# EAGLE design PCM3060 Guitar Cape (EAGLE 6.6.0)
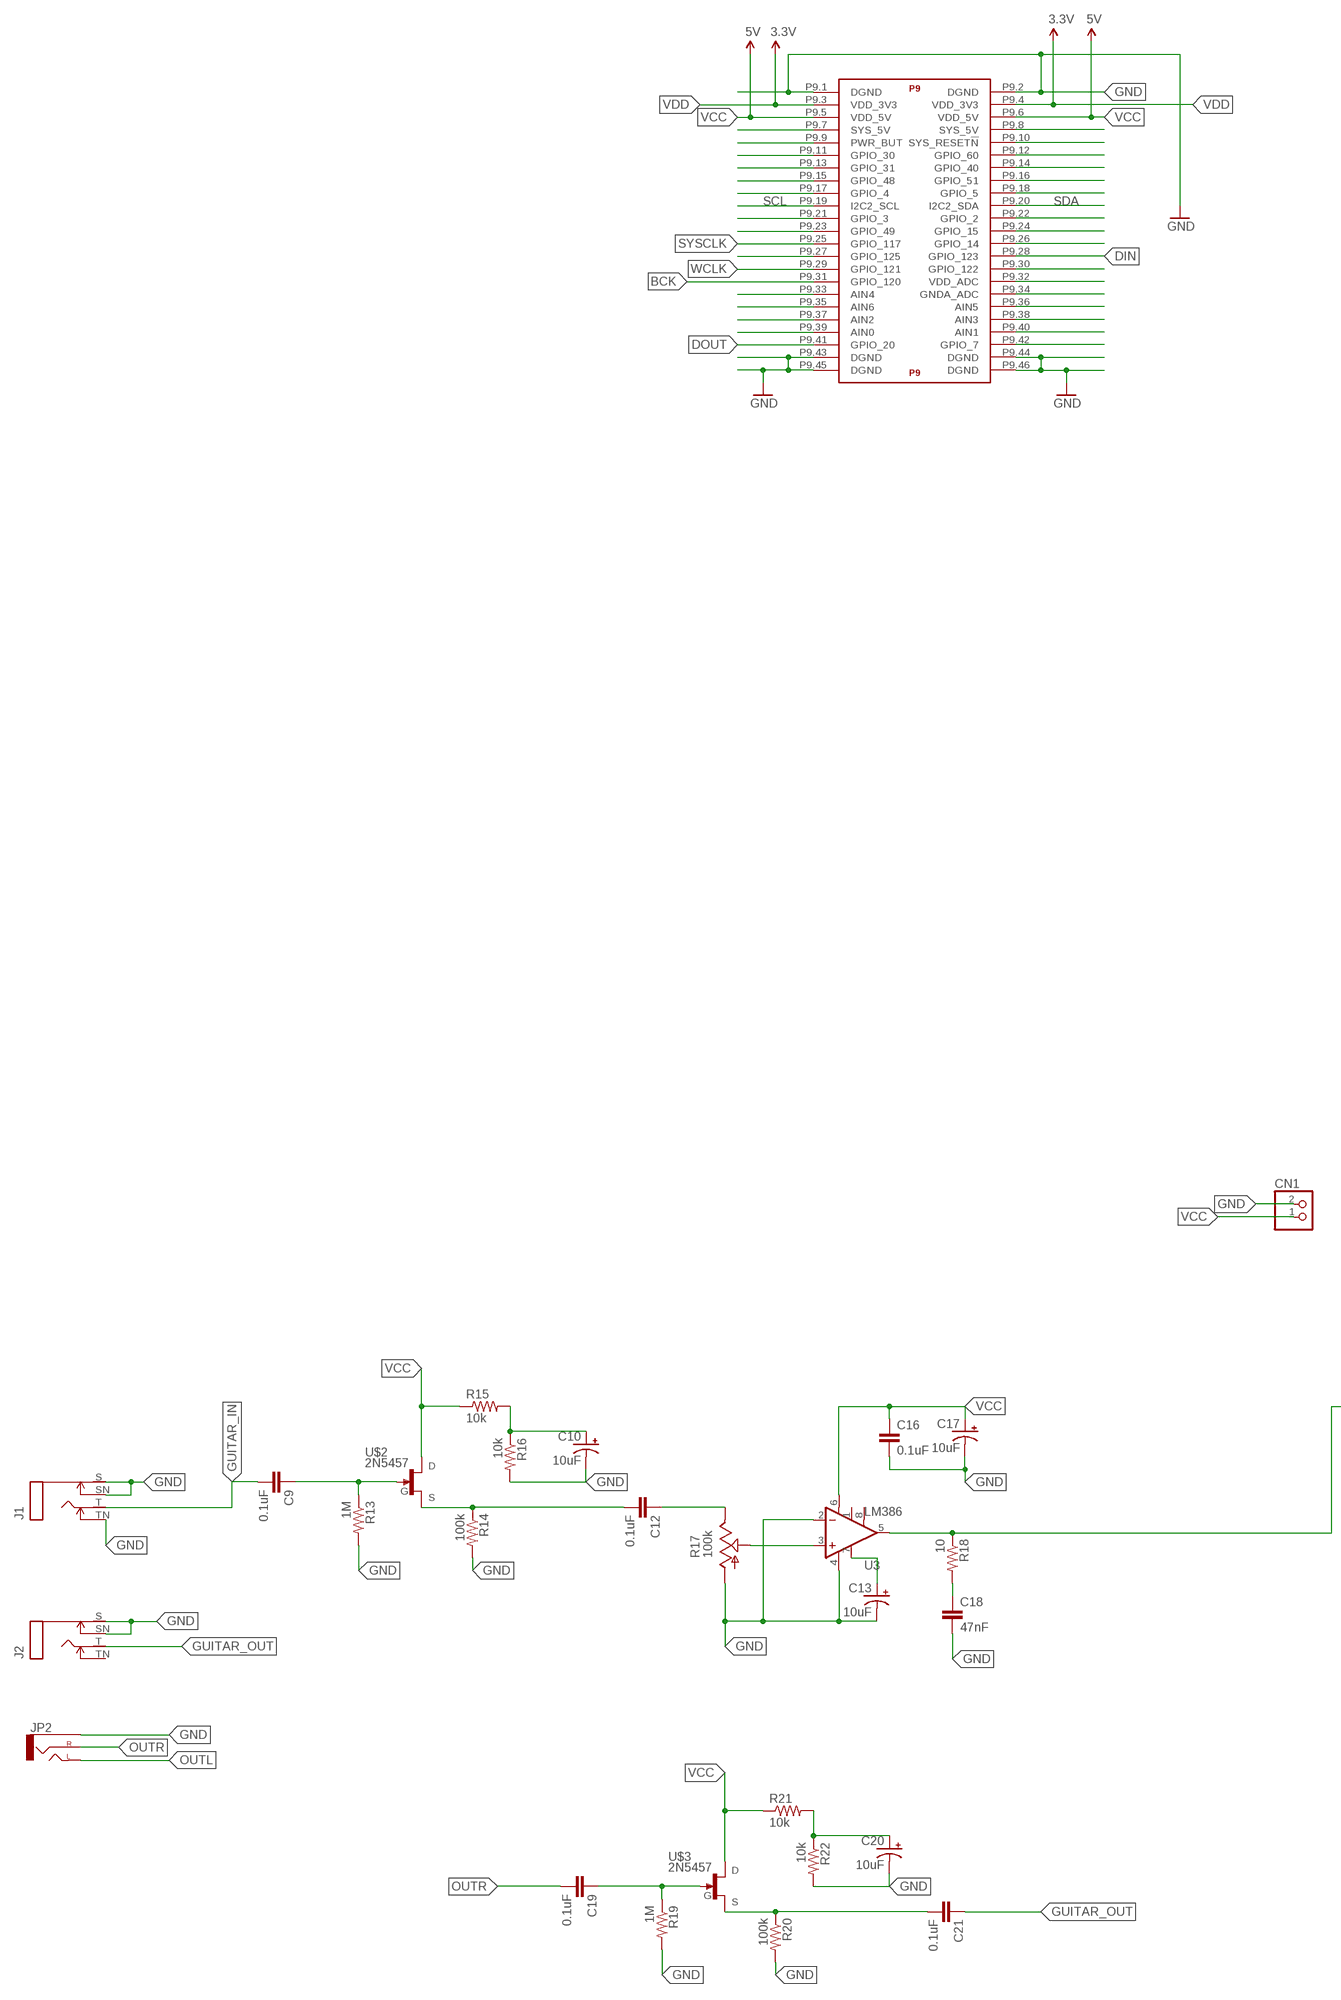
[diagram p0: schematic, sheet 1, part 1 of 2]
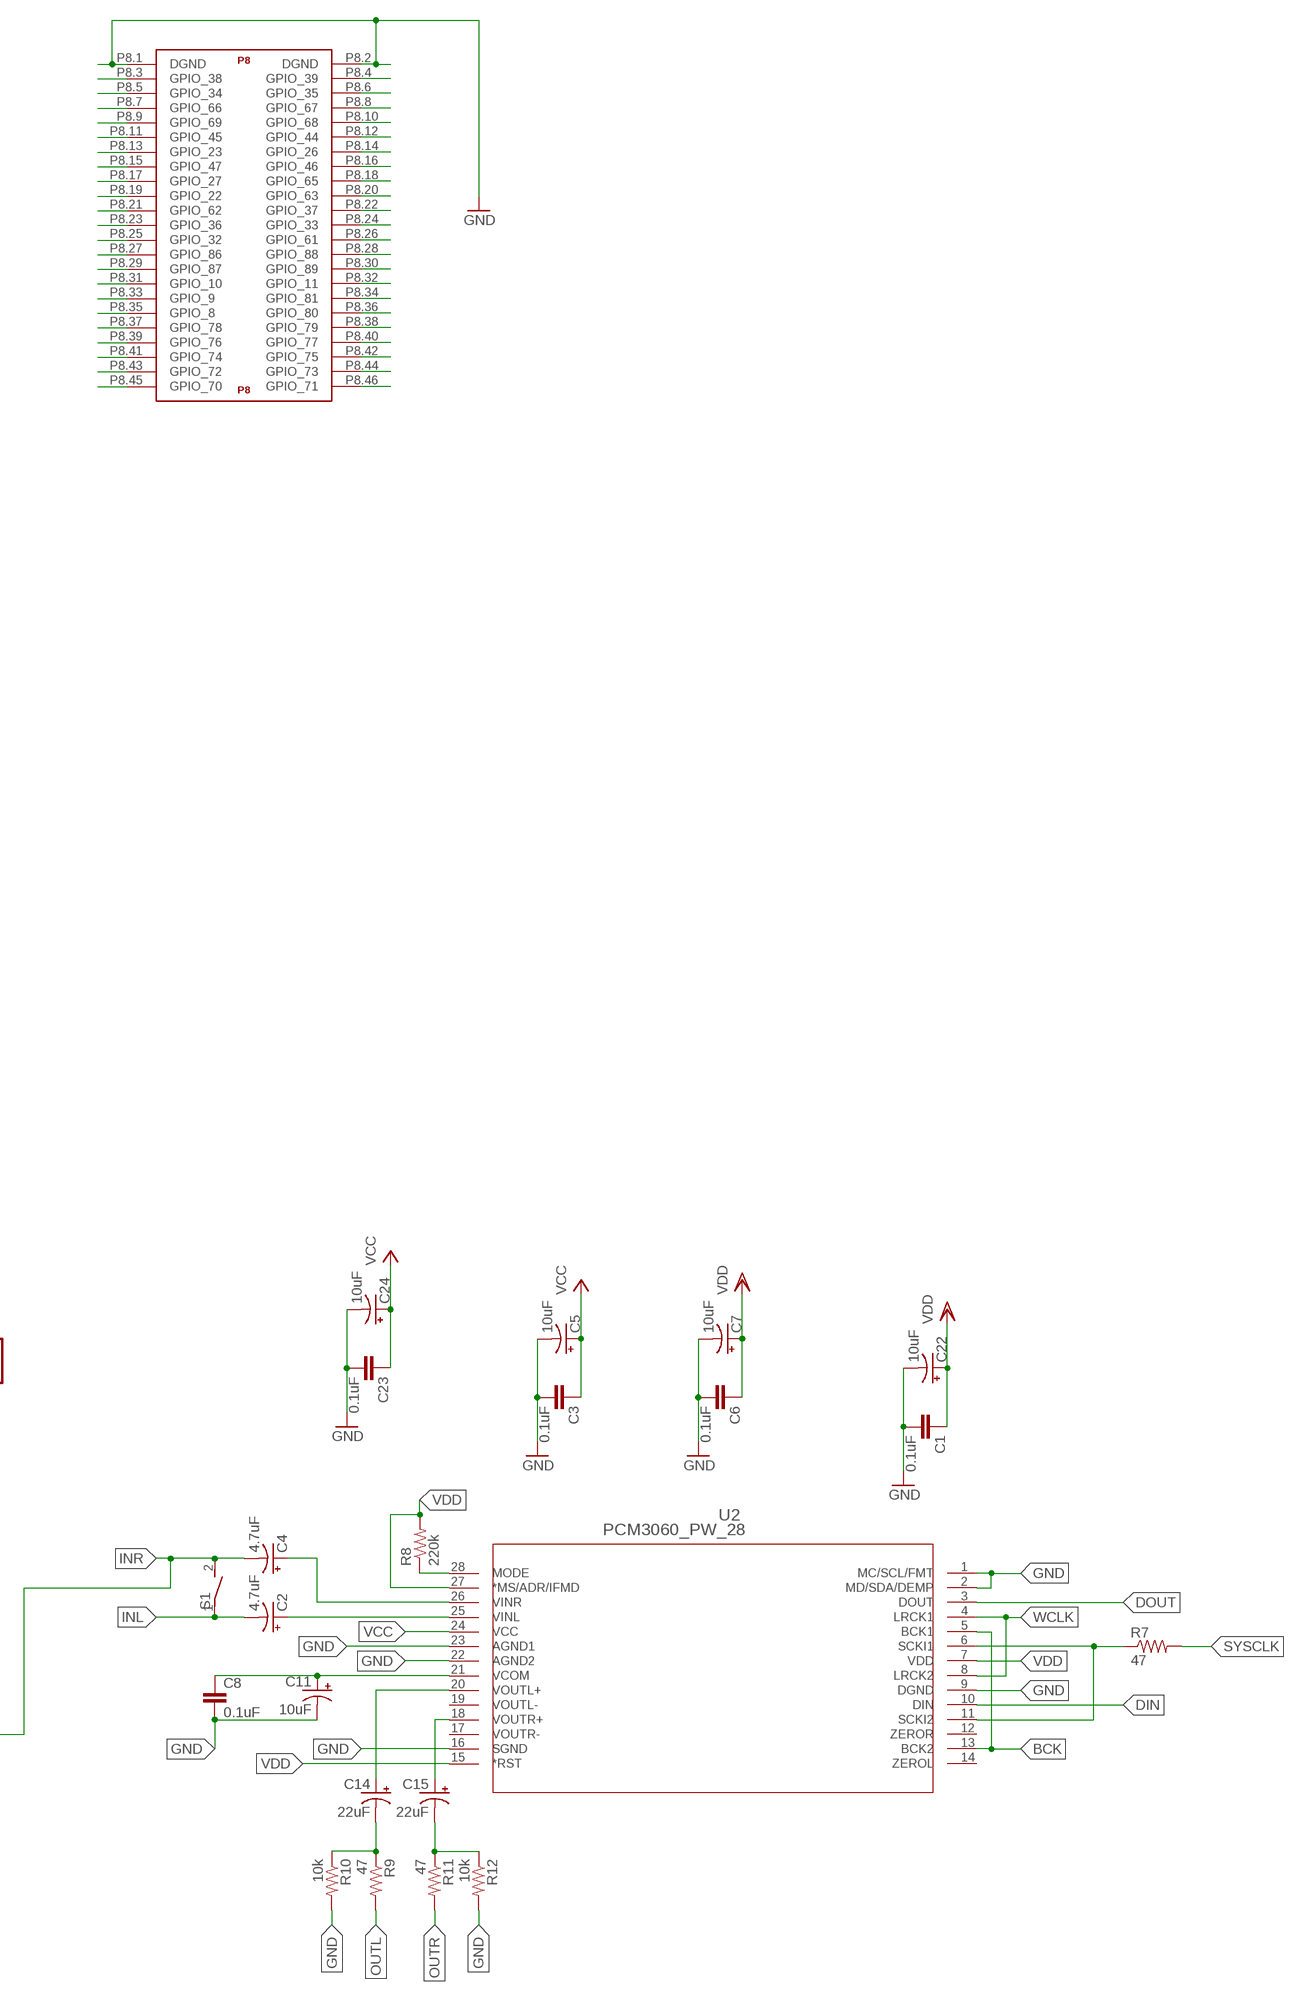
[diagram p1: schematic, sheet 1, part 2 of 2]

## Parts
C1  0.1uF  0.1UF-25V-5%(0603)  [0603-CAP]
C2  4.7uF  CAP_POLPTH2  [CPOL-RADIAL-10UF-25V]
C3  0.1uF  0.1UF-25V-5%(0603)  [0603-CAP]
C4  4.7uF  CAP_POLPTH2  [CPOL-RADIAL-10UF-25V]
C5  10uF  CAP_POLPTH2  [CPOL-RADIAL-10UF-25V]
C6  0.1uF  0.1UF-25V-5%(0603)  [0603-CAP]
C7  10uF  CAP_POLPTH2  [CPOL-RADIAL-10UF-25V]
C8  0.1uF  0.1UF-25V-5%(0603)  [0603-CAP]
C9  0.1uF  0.1UF-25V-5%(0603)  [0603-CAP]
C10  10uF  CAP_POLPTH2  [CPOL-RADIAL-10UF-25V]
C11  10uF  CAP_POLPTH2  [CPOL-RADIAL-10UF-25V]
C12  0.1uF  0.1UF-25V-5%(0603)  [0603-CAP]
C13  10uF  CAP_POLPTH2  [CPOL-RADIAL-10UF-25V]
C14  22uF  CAP_POLPTH2  [CPOL-RADIAL-10UF-25V]
C15  22uF  CAP_POLPTH2  [CPOL-RADIAL-10UF-25V]
C16  0.1uF  0.1UF-25V-5%(0603)  [0603-CAP]
C17  10uF  CAP_POLPTH2  [CPOL-RADIAL-10UF-25V]
C18  47nF  47NF(0.047UF/47000PF)-25V-5%(0603)SMD  [0603-CAP]
C19  0.1uF  0.1UF-25V-5%(0603)  [0603-CAP]
C20  10uF  CAP_POLPTH2  [CPOL-RADIAL-10UF-25V]
C21  0.1uF  0.1UF-25V-5%(0603)  [0603-CAP]
C22  10uF  CAP_POLPTH2  [CPOL-RADIAL-10UF-25V]
C23  0.1uF  0.1UF-25V-5%(0603)  [0603-CAP]
C24  10uF  CAP_POLPTH2  [CPOL-RADIAL-10UF-25V]
CN1  JST_2PIN-THM  [JST-PH-2-THM]
J1  MONOSW  [NMJ4HCD2]
J2  MONOSW  [NMJ4HCD2]
JP2  AUDIO-JACK2.5MM  [STEREOJACK2.5MM_STEREOJACK2.5MM]
R7  47  RESISTOR1206  [1206]
R8  220k  RESISTOR1206  [1206]
R9  47  RESISTOR1206  [1206]
R10  10k  RESISTOR1206  [1206]
R11  47  RESISTOR1206  [1206]
R12  10k  RESISTOR1206  [1206]
R13  1M  RESISTOR1206  [1206]
R14  100k  RESISTOR1206  [1206]
R15  10k  RESISTOR1206  [1206]
R16  10k  RESISTOR1206  [1206]
R17  100k  TRIM_US-RJ9W  [RJ9W]
R18  10  RESISTOR1206  [1206]
R19  1M  RESISTOR1206  [1206]
R20  100k  RESISTOR1206  [1206]
R21  10k  RESISTOR1206  [1206]
R22  10k  RESISTOR1206  [1206]
S1  DS01E  [DS-01]
U2  PCM3060_PW_28  [PW28]
U3  LM386  [DIP08]
U$1  BEAGLE_BONE_BLACK_CAPE  [BEAGLE_BONE_BLACK_CAPE]
U$2  2N5457  [TO-92]
U$3  2N5457  [TO-92]

## Nets
BCK: U2.5(BCK1) U2.13(BCK2) U$1.P9.31(P9:GPIO_120)
DIN: U2.10(DIN) U$1.P9.28(P9:GPIO_123)
DOUT: U2.3(DOUT) U$1.P9.41(P9:GPIO_20)
GND: C1.2 C3.2 C5.2(-) C6.2 C7.2(-) C8.2 C10.2(-) C11.2(-) C13.2(-) C16.2 C17.2(-) C18.2 C20.2(-) C22.2(-) C23.2 C24.2(-) CN1.2 J1.S J1.SN J1.TN J2.S J2.SN JP2.RING1(SLEEVE) R10.2 R12.2 R13.2 R14.2 R16.2 R17.A R19.2 R20.2 R22.2 U2.1(MC/SCL/FMT) U2.2(MD/SDA/DEMP) U2.9(DGND) U2.16(SGND) U2.22(AGND2) U2.23(AGND1) U3.2(-IN) U3.4(V-) U$1.P8.1(P8:DGND) U$1.P8.2(P8:DGND) U$1.P9.1(P9:DGND) U$1.P9.2(P9:DGND) U$1.P9.43(P9:DGND) U$1.P9.44(P9:DGND) U$1.P9.45(P9:DGND) U$1.P9.46(P9:DGND)
GUITAR_IN: C9.2 J1.T
GUITAR_OUT: C21.1 J2.T
INL: C2.2(-) S1.1
INR: C4.2(-) R18.1 S1.2 U3.5(OUT)
N$2: U$1.P8.45(P8:GPIO_70)
N$3: C2.1(+) U2.25(VINL)
N$4: U$1.P8.43(P8:GPIO_72)
N$5: U$1.P8.41(P8:GPIO_74)
N$7: R7.1 U2.6(SCKI1) U2.11(SCKI2)
N$8: C8.1 C11.1(+) U2.21(VCOM)
N$9: U$1.P8.39(P8:GPIO_76)
N$12: U$1.P8.37(P8:GPIO_78)
N$13: U$1.P8.35(P8:GPIO_8)
N$14: U$1.P8.33(P8:GPIO_9)
N$15: U$1.P8.31(P8:GPIO_10)
N$16: U$1.P8.29(P8:GPIO_87)
N$17: U$1.P8.27(P8:GPIO_86)
N$18: U$1.P8.25(P8:GPIO_32)
N$19: U$1.P8.23(P8:GPIO_36)
N$20: U$1.P8.21(P8:GPIO_62)
N$21: U$1.P8.19(P8:GPIO_22)
N$22: U$1.P8.17(P8:GPIO_27)
N$23: U$1.P8.15(P8:GPIO_47)
N$24: U$1.P8.13(P8:GPIO_23)
N$25: U$1.P8.11(P8:GPIO_45)
N$26: U$1.P8.9(P8:GPIO_69)
N$27: U$1.P8.7(P8:GPIO_66)
N$28: U$1.P8.5(P8:GPIO_34)
N$29: U$1.P8.3(P8:GPIO_38)
N$30: R8.1 U2.28(MODE)
N$31: U$1.P8.46(P8:GPIO_71)
N$32: U$1.P8.44(P8:GPIO_73)
N$33: U$1.P8.42(P8:GPIO_75)
N$34: U$1.P8.40(P8:GPIO_77)
N$35: U$1.P8.38(P8:GPIO_79)
N$36: U$1.P8.36(P8:GPIO_80)
N$37: U$1.P8.34(P8:GPIO_81)
N$38: U$1.P8.32(P8:GPIO_11)
N$39: U$1.P8.30(P8:GPIO_89)
N$40: U$1.P8.28(P8:GPIO_88)
N$41: U$1.P8.26(P8:GPIO_61)
N$42: U$1.P8.24(P8:GPIO_33)
N$43: U$1.P8.22(P8:GPIO_37)
N$44: U$1.P8.20(P8:GPIO_63)
N$45: U$1.P8.18(P8:GPIO_65)
N$46: U$1.P8.16(P8:GPIO_46)
N$47: U$1.P8.14(P8:GPIO_26)
N$48: U$1.P8.12(P8:GPIO_44)
N$49: U$1.P8.10(P8:GPIO_68)
N$50: U$1.P8.8(P8:GPIO_67)
N$51: U$1.P8.6(P8:GPIO_35)
N$52: U$1.P8.4(P8:GPIO_39)
N$53: C4.1(+) U2.26(VINR)
N$54: C14.1(+) U2.20(VOUTL+)
N$55: C15.1(+) U2.18(VOUTR+)
N$56: U$1.P9.42(P9:GPIO_7)
N$57: U$1.P9.40(P9:AIN1)
N$58: U$1.P9.38(P9:AIN3)
N$59: U$1.P9.36(P9:AIN5)
N$60: U$1.P9.34(P9:GNDA_ADC)
N$61: U$1.P9.32(P9:VDD_ADC)
N$62: U$1.P9.30(P9:GPIO_122)
N$64: U$1.P9.26(P9:GPIO_14)
N$65: U$1.P9.24(P9:GPIO_15)
N$66: U$1.P9.22(P9:GPIO_2)
N$67: C14.2(-) R9.1 R10.1
N$68: U$1.P9.18(P9:GPIO_5)
N$69: U$1.P9.16(P9:GPIO_51)
N$70: U$1.P9.14(P9:GPIO_40)
N$71: U$1.P9.12(P9:GPIO_60)
N$72: U$1.P9.10(P9:SYS_RESET!N)
N$73: U$1.P9.8(P9:SYS_5V)
N$74: C15.2(-) R11.1 R12.1
N$75: C9.1 R13.1 U$2.3(G)
N$76: C12.2 R14.1 U$2.2(S)
N$77: C10.1(+) R15.2 R16.1
N$78: R17.S U3.3(+IN)
N$80: U$1.P9.39(P9:AIN0)
N$81: U$1.P9.37(P9:AIN2)
N$82: U$1.P9.35(P9:AIN6)
N$83: U$1.P9.33(P9:AIN4)
N$86: U$1.P9.27(P9:GPIO_125)
N$88: U$1.P9.23(P9:GPIO_49)
N$89: U$1.P9.21(P9:GPIO_3)
N$90: C13.1(+) U3.7(BP)
N$91: U$1.P9.17(P9:GPIO_4)
N$92: U$1.P9.15(P9:GPIO_48)
N$93: U$1.P9.13(P9:GPIO_31)
N$94: U$1.P9.11(P9:GPIO_30)
N$95: U$1.P9.9(P9:PWR_BUT)
N$96: U$1.P9.7(P9:SYS_5V)
N$97: C18.1 R18.2
N$98: C12.1 R17.E
N$99: C19.1 R19.1 U$3.3(G)
N$100: C21.2 R20.1 U$3.2(S)
N$101: C20.1(+) R21.2 R22.1
OUTL: JP2.SHIELD(LEFT) R9.2
OUTR: C19.2 JP2.TIP(RIGHT) R11.2
SCL: U$1.P9.19(P9:I2C2_SCL)
SDA: U$1.P9.20(P9:I2C2_SDA)
SYSCLK: R7.2 U$1.P9.25(P9:GPIO_117)
VCC: C3.1 C5.1(+) C16.1 C17.1(+) C23.1 C24.1(+) CN1.1 R15.1 R21.1 U2.24(VCC) U3.6(V+) U$1.P9.5(P9:VDD_5V) U$1.P9.6(P9:VDD_5V) U$2.1(D) U$3.1(D) ; supply symbol labelled 5V
VDD: C1.1 C6.1 C7.1(+) C22.1(+) R8.2 U2.7(VDD) U2.15(*RST) U2.27(*MS/ADR/IFMD) U$1.P9.3(P9:VDD_3V3) U$1.P9.4(P9:VDD_3V3) ; supply symbol labelled 3.3V
WCLK: U2.4(LRCK1) U2.8(LRCK2) U$1.P9.29(P9:GPIO_121)
Unconnected: J2.TN U2.12(ZEROR) U2.14(ZEROL) U2.17(VOUTR-) U2.19(VOUTL-) U3.1(GAIN) U3.8(GAIN)

## Library data of the parts
C1 C3 C6 C8 C9 C12 C16 C19 C21 C23 = SparkFun-Capacitors:0.1UF-25V-5%(0603): CAP-08604; PROD_ID: CAP-08604
C2 C4 C5 C7 C10 C11 C13-C15 C17 C20 C22 C24 = SparkFun-Capacitors:CAP_POL: Capacitor Polarized These are standard SMD and PTH capacitors. Normally 10uF, 47uF, and 100uF in electrolytic and tantalum varieties. Always verify the external diameter of the through hole cap, it varies with capacity, voltage, and manufacturer. The EIA devices should be standard.
C18 = SparkFun-Capacitors:47NF(0.047UF/47000PF)-25V-5%(0603): CAP-08605; PROD_ID: CAP-08605
CN1 = adafruit:JST_2PIN: JST 2-Pin Connectors of various flavors SMT-RA (S2B-PH-SM4) 4UConnector #17311 SMT (B2B-PH-SM4) THM-RA (S2B-PH) THM (B2B-PH)
J1 J2 = gm-jacks:MONOSW
JP2 = SparkFun-Connectors:AUDIO-JACK: 3.5mm Audio Jack Simple 3.5mm common PCB mount audio jack. SKU: PRT-08032
R7-R16 R18-R22 = SparkFun-Resistors:RESISTOR: Resistor Basic schematic elements and footprints for 0603, 1206, and PTH resistors.
R17 = pot:TRIM_US-: POTENTIOMETER
S1 = switch-dil:DS01E: DIL/CODE SWITCH; OC_FARNELL: unknown; OC_NEWARK: unknown
U2 = PCM3060:PCM3060_PW_28; DATASHEETURL: http://www.ti.com/lit/gpn/PCM3060; DESCRIPTION: 24-bit Asynchronous Stereo Audio Codec with 96/192kHz sampling rate; FAMILY_NAME: Audio CODEC; GENERIC_PART_NUMBER: PCM3060; INDUSTRY_STD_PKG_TYPE: TSSOP; MANUFACTURER: Texas Instruments; MANUFACTURER_PART_NUMBER: pcm3060_pw_28; PACKAGE_DESIGNATOR: PW; PIN_COUNT: 28; VENDOR: Texas Instruments
U3 = SparkFun-AnalogIC:LM386: low voltage audio power amplifier
U$1 = SparkFun-Boards:BEAGLE_BONE_BLACK_CAPE
U$2 U$3 = transistors:2N54*: 2N54xx N-channel JFET

## Board
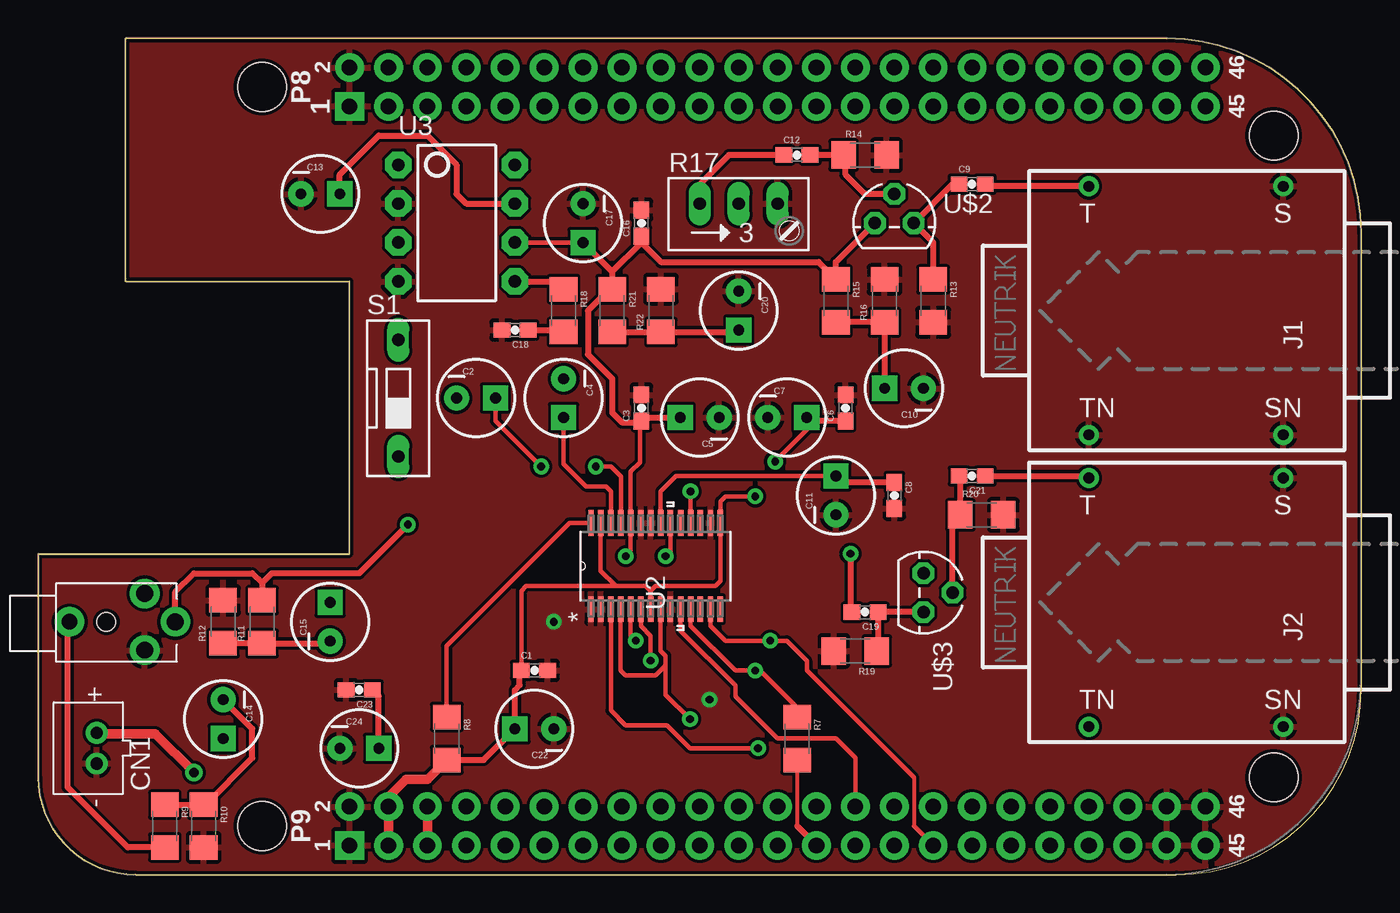
[diagram p2: board, top side]
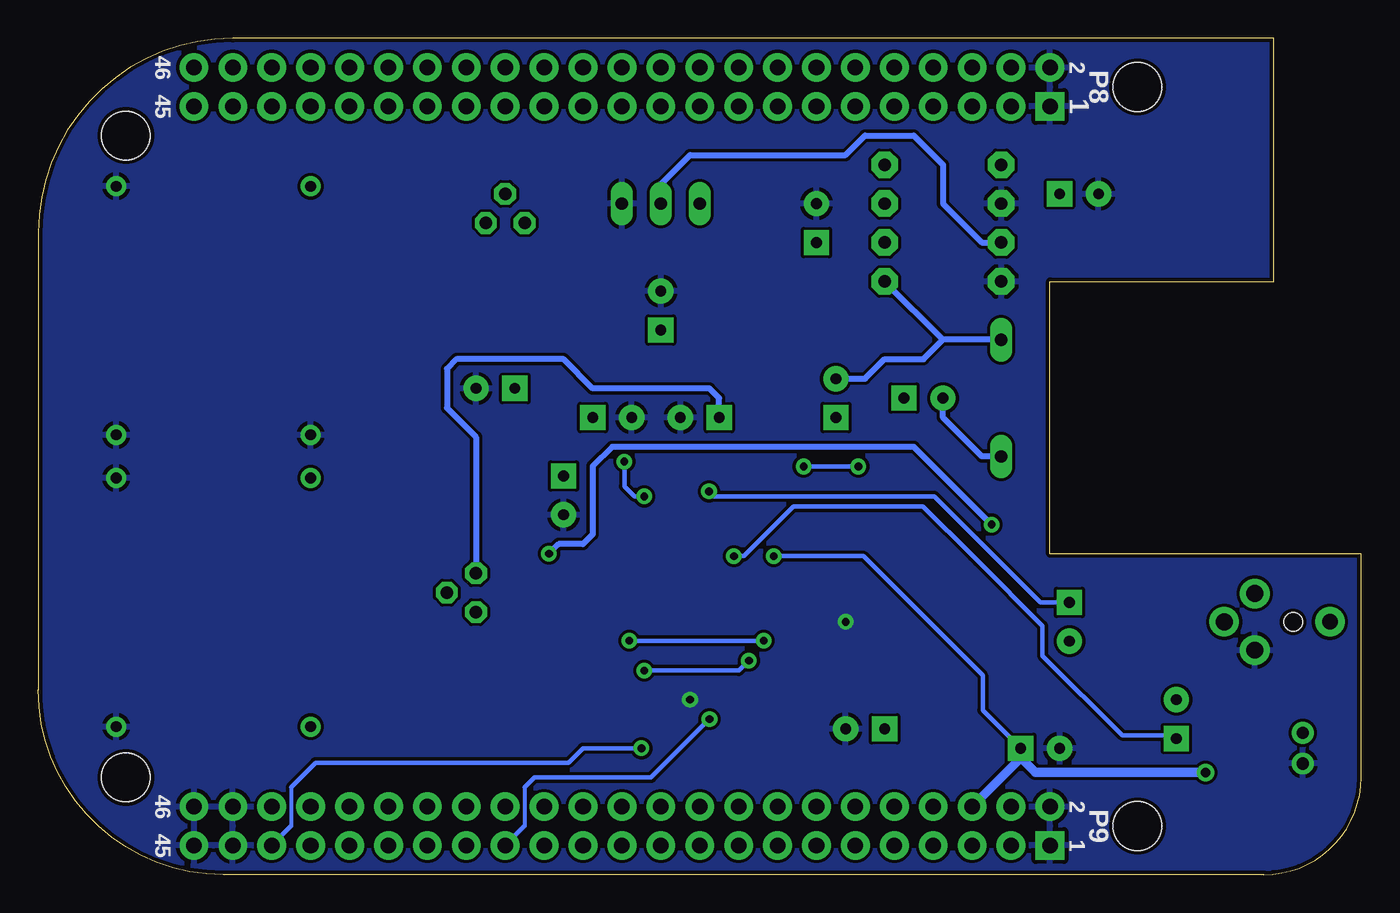
[diagram p3: board, bottom side, seen from below]

Size 86.36 x 54.61 mm. Coordinates in mm from the lower left corner, seen from the top.
Outline: 0,20.95 20.32,20.95 20.32,38.73 5.71,38.73 5.71,54.61 73.66,54.61 arc-90 86.36,41.91 86.36,12.06 arc-90 74.3,0 6.35,0 arc-90 0,6.35 0,20.95
Copper layers (1*16): Top 0.035mm / dielectric 1.5mm / Bottom 0.035mm
Design rules "SparkFun *": minimum track width 8mil, minimum drill 10mil, track to track 8mil, track to pad 8mil, pad to pad 8mil, via to via 8mil, smd to smd 8mil, copper to edge 10mil, drill to drill 8mil, minimum pad ring 12mil, minimum via ring 10mil, stop-mask expansion 4mil, vias tented up to drill 25mil, thermal gap 10mil

### Footprints (pad centres in the part's own frame; a part is rotated, then mirrored left to right if it is on the bottom)
0603-CAP = smd 1.1 x 1: 1 -0.85,0; 2 0.85,0
CPOL-RADIAL-10UF-25V = drill 0.7 pad 1.651 square: 1 1.27,0 | drill 0.7 pad 1.651: 2 -1.27,0
JST-PH-2-THM = drill 0.8 pad 1.422: 1 1,0; 2 -1,0
NMJ4HCD2 = drill 0.7: S 6.35,8.115; SN 6.35,-8.115; T -6.35,8.115; TN -6.35,-8.115
STEREOJACK2.5MM_STEREOJACK2.5MM = drill 1.1 pad 1.93: RING1 2.5,-1.85; RING2 2.5,1.85; TIP 4.5,0 | drill 1 pad 1.93: SHIELD -2.4,0 | hole 1.2: 0,0
1206 = smd 1.6 x 1.8: 1 -1.4,0; 2 1.4,0
RJ9W = drill 0.813 long: A 2.54,0.635; E -2.54,0.635; S 0,0.635
DS-01 = drill 0.813 long: 1 0,-3.81; 2 0,3.81
PW28 = smd 1.676 x 0.356: 1 -2.819,4.216; 2 -2.819,3.581; 3 -2.819,2.921; 4 -2.819,2.286; 5 -2.819,1.626; 6 -2.819,0.965; 7 -2.819,0.33; 8 -2.819,-0.33; 9 -2.819,-0.965; 10 -2.819,-1.626; 11 -2.819,-2.286; 12 -2.819,-2.921; 13 -2.819,-3.581; 14 -2.819,-4.216; 15 2.819,-4.216; 16 2.819,-3.581; 17 2.819,-2.921; 18 2.819,-2.286; 19 2.819,-1.626; 20 2.819,-0.965; 21 2.819,-0.33; 22 2.819,0.33; 23 2.819,0.965; 24 2.819,1.626; 25 2.819,2.286; 26 2.819,2.921; 27 2.819,3.581; 28 2.819,4.216
DIP08 = drill 0.813 pad 1.727 octagon: 1 -3.81,-3.81; 2 -1.27,-3.81; 3 1.27,-3.81; 4 3.81,-3.81; 5 3.81,3.81; 6 1.27,3.81; 7 -1.27,3.81; 8 -3.81,3.81
BEAGLE_BONE_BLACK_CAPE = drill 1.016 pad 1.88 square: P8.1 20.32,50.165; P9.1 20.32,1.905 | drill 1.016 pad 1.88: P8.2 20.32,52.705; P8.3 22.86,50.165; P8.4 22.86,52.705; P8.5 25.4,50.165; P8.6 25.4,52.705; P8.7 27.94,50.165; P8.8 27.94,52.705; P8.9 30.48,50.165; P8.10 30.48,52.705; P8.11 33.02,50.165; P8.12 33.02,52.705; P8.13 35.56,50.165; P8.14 35.56,52.705; P8.15 38.1,50.165; P8.16 38.1,52.705; P8.17 40.64,50.165; P8.18 40.64,52.705; P8.19 43.18,50.165; P8.20 43.18,52.705; P8.21 45.72,50.165; P8.22 45.72,52.705; P8.23 48.26,50.165; P8.24 48.26,52.705; P8.25 50.8,50.165; P8.26 50.8,52.705; P8.27 53.34,50.165; P8.28 53.34,52.705; P8.29 55.88,50.165; P8.30 55.88,52.705; P8.31 58.42,50.165; P8.32 58.42,52.705; P8.33 60.96,50.165; P8.34 60.96,52.705; P8.35 63.5,50.165; P8.36 63.5,52.705; P8.37 66.04,50.165; P8.38 66.04,52.705; P8.39 68.58,50.165; P8.40 68.58,52.705; P8.41 71.12,50.165; P8.42 71.12,52.705; P8.43 73.66,50.165; P8.44 73.66,52.705; P8.45 76.2,50.165; P8.46 76.2,52.705; P9.2 20.32,4.445; P9.3 22.86,1.905; P9.4 22.86,4.445; P9.5 25.4,1.905; P9.6 25.4,4.445; P9.7 27.94,1.905; P9.8 27.94,4.445; P9.9 30.48,1.905; P9.10 30.48,4.445; P9.11 33.02,1.905; P9.12 33.02,4.445; P9.13 35.56,1.905; P9.14 35.56,4.445; P9.15 38.1,1.905; P9.16 38.1,4.445; P9.17 40.64,1.905; P9.18 40.64,4.445; P9.19 43.18,1.905; P9.20 43.18,4.445; P9.21 45.72,1.905; P9.22 45.72,4.445; P9.23 48.26,1.905; P9.24 48.26,4.445; P9.25 50.8,1.905; P9.26 50.8,4.445; P9.27 53.34,1.905; P9.28 53.34,4.445; P9.29 55.88,1.905; P9.30 55.88,4.445; P9.31 58.42,1.905; P9.32 58.42,4.445; P9.33 60.96,1.905; P9.34 60.96,4.445; P9.35 63.5,1.905; P9.36 63.5,4.445; P9.37 66.04,1.905; P9.38 66.04,4.445; P9.39 68.58,1.905; P9.40 68.58,4.445; P9.41 71.12,1.905; P9.42 71.12,4.445; P9.43 73.66,1.905; P9.44 73.66,4.445; P9.45 76.2,1.905; P9.46 76.2,4.445 | hole 3.175: 14.605,3.175; 80.645,6.35; 80.645,48.26; 14.605,51.435
TO-92 = drill 0.813 octagon: 1 -1.27,0; 2 0,1.905; 3 1.27,0

### Placement (x,y rotation side)
C1  32.38,13.34 0 top
C2  28.57,31.11 0 top
C3  39.37,30.48 90 top
C4  34.29,31.11 270 top
C5  43.18,29.84 180 top
C6  52.7,30.48 90 top
C7  48.9,29.84 0 top
C8  55.88,24.77 270 top
C9  60.96,45.09 0 top
C10  56.52,31.75 180 top
C11  52.07,24.77 90 top
C12  49.53,46.99 0 top
C13  18.41,44.45 0 top
C14  12.06,10.16 270 top
C15  19.05,16.51 90 top
C16  39.37,42.55 90 top
C17  35.56,42.55 270 top
C18  31.11,35.56 180 top
C19  53.98,17.14 180 top
C20  45.72,36.83 270 top
C21  60.96,26.04 180 top
C22  32.38,9.53 180 top
C23  20.95,12.06 180 top
C24  20.95,8.26 0 top
CN1  3.81,8.26 90 top
J1  74.93,36.83 0 top
J2  74.93,17.78 0 top
JP2  4.45,16.51 0 top
R7  49.53,8.89 270 top
R8  26.67,8.89 270 top
R9  8.26,3.17 270 top
R10  10.79,3.17 270 top
R11  14.61,16.51 90 top
R12  12.06,16.51 90 top
R13  58.42,37.47 270 top
R14  53.98,46.99 0 top
R15  52.07,37.47 270 top
R16  55.24,37.47 90 top
R17  45.72,43.18 0 top
R18  34.29,36.83 270 top
R19  53.34,14.61 180 top
R20  61.59,23.5 0 top
R21  37.47,36.83 270 top
R22  40.64,36.83 90 top
S1  23.5,31.11 0 top
U2  40.3,20.15 90 top
U3  27.3,42.55 270 top
U$1  0,0 0 top
U$2  55.88,42.55 0 top
U$3  57.78,18.41 270 top

### Tracks (layer width: path | path; a pad name or v marks a point on that pad's centre or on a via)
BCK  (via drill 0.51)
  Top 0.254: 57.15,6.35 57.15,3.17
  Top 0.305: U2.13 43.88,16.24 44.85,15.28 v47.77,15.28 48.86,15.28 50.16,13.97 50.16,13.34 57.15,6.35 | U2.5 38.67,15.6 v39,15.28 | 57.15,3.17 U$1.P9.31
  Bottom 0.305: v39,15.28 v47.77,15.28
DIN
  Top 0.305: U2.10 41.93,15.92 45.5,12.35 45.5,11.65 48.26,8.89 52.07,8.89 53.34,7.62 U$1.P9.28
DOUT  (via drill 0.51)
  Top 0.305: U2.3 37.38,10.72 38.35,9.75 41.05,9.75 42.55,8.26 v46.99,8.26
  Bottom 0.254: 69.85,5.71 69.85,3.17
  Bottom 0.305: v46.99,8.26 50.8,8.26 51.75,7.3 68.26,7.3 69.85,5.71 | 69.85,3.17 U$1.P9.41
GND  (via drill 0.51)
  other vias: 33.66,16.51 43.81,11.43
  pour Top (isolate 0.203, rank 6): 0,20.95 20.32,20.95 20.32,38.73 5.71,38.73 5.71,54.61 73.66,54.61 arc-90 86.36,41.91 86.36,12.7 arc-90 73.66,0 6.35,0 arc-90 0,6.35
  pour Bottom (isolate 0.203): 0,20.95 20.32,20.95 20.32,38.73 5.71,38.73 5.71,54.61 73.66,54.61 arc-90 86.36,41.91 86.36,12.7 arc-90 73.66,0 6.35,0 arc-90 0,6.35
GUITAR_IN
  Top 0.406: J1.T 61.95,44.95 C9.2
GUITAR_OUT
  Top 0.406: C21.1 68.44,26.04 J2.T
INL
  Bottom 0.406: S1.1 24.77,27.3 27.3,29.84 C2.2
INR
  Top 0.406: U3.5 33.78,38.73 R18.1
  Bottom 0.406: S1.2 27.3,34.92 | 27.3,34.92 U3.5 | C4.2 32.38,32.38 31.11,33.66 28.57,33.66 27.3,34.92
N$3  (via drill 0.51)
  Top 0.305: C2.1 29.84,29.63 v32.83,26.65 | v36.4,26.65 37.38,26.65 38.02,26 38.02,22.98 U2.25
  Bottom 0.305: v32.83,26.65 v36.4,26.65
N$7  (via drill 0.51)
  Top 0.305: U2.6 39.34,16.24 39.98,15.6 v39.98,13.97 | 42.58,17.32 U2.11 42.59,16.24 45.5,13.32 v46.8,13.32 47.12,13.32 49.4,11.05 49.4,10.42 R7.1
  Bottom 0.305: v39.98,13.97 40.62,13.32 v46.8,13.32
N$8
  Top 0.305: C11.1 41.63,26.04 40.62,25.02 U2.21
  Top 0.406: C8.1 52.49,25.61 C11.1
N$30
  Top 0.305: U2.28 34.67,22.97 26.65,14.95 26.65,10.31 R8.1
N$53
  Top 0.305: C4.1 34.29,26.81 35.75,25.35 37.05,25.35 37.38,25.02 U2.26
N$54  (via drill 0.51)
  Top 0.305: U2.20 41.27,21.11 v40.95,20.8
  Bottom 0.305: C14.1 12.28,9.1 15.6,9.1 20.8,14.3 20.8,16.25 25.02,20.48 25.35,20.8 28.6,24.05 37.05,24.05 40.3,20.8 v40.95,20.8
N$55  (via drill 0.51)
  Top 0.305: v42.58,25.02 42.58,22.98 U2.18
  Bottom 0.305: v42.58,25.02 42.25,24.7 27.88,24.7 20.95,17.78 C15.1
N$67
  Top 0.406: R9.1 R10.1 10.93,4.58 13.97,7.62 13.97,9.53 C14.2
N$74
  Top 0.406: C15.2 18.92,15.11 R11.1 R12.1
N$75
  Top 0.406: C9.1 59.69,45.09 U$2.3 58.42,41.27 R13.1
N$76
  Top 0.406: U$2.2 53.98,44.45 52.7,45.72 52.7,46.86 R14.1 C12.2
N$77
  Top 0.406: R15.2 R16.1 C10.1
N$78
  Bottom 0.406: R17.S 45.72,45.09 43.81,46.99 33.66,46.99 32.38,48.26 29.21,48.26 27.3,46.35 27.3,43.81 24.77,41.27 U3.3
N$90
  Top 0.406: C13.1 19.68,45.72 22.23,48.26 25.4,48.26 27.3,46.35 27.3,44.45 27.94,43.81 U3.7
N$97
  Top 0.406: C18.1 34.16,35.56 R18.2
N$98
  Top 0.406: C12.1 45.09,46.99 43.18,45.09 R17.E
N$99
  Top 0.406: U$3.3 C19.1 54.83,14.69 R19.1
N$100
  Top 0.406: U$3.2 59.69,22.99 R20.1 60.2,25.95 C21.2
N$101
  Top 0.406: C20.1 45.59,35.43 R22.1 R21.2
OUTL
  Top 0.406: R9.2 5.84,1.77 1.91,5.71 1.91,16.37 JP2.SHIELD
OUTR  (via drill 0.51)
  Top 0.406: JP2.TIP 8.95,18.47 10.16,19.68 13.97,19.68 14.61,19.05 | 14.61,19.05 R11.2 | 14.61,19.05 15.24,19.68 20.95,19.68 v24.13,22.86 | v53.02,20.95 53.02,17.25 C19.2
  Bottom 0.406: v53.02,20.95 52.39,21.59 50.8,21.59 50.16,22.23 50.16,26.67 48.9,27.94 29.21,27.94 v24.13,22.86
SYSCLK
  Top 0.254: R7.2 49.53,3.17
  Top 0.406: 49.53,3.17 U$1.P9.25
VCC  (via drill 0.51, 0.64)
  Top 0.305: 39.27,29.53 39.27,26.92 38.67,26.32 U2.24 | U2.24 | C17.1 U3.6 | U2.24 38.67,21.12 v38.35,20.8
  Top 0.406: C17.1 37.47,39.37 | 37.47,39.37 R21.1 37.28,38.23 35.88,36.83 35.88,33.97 37.47,32.38 37.47,30.16 38.1,29.53 39.27,29.53 C3.1 39.59,29.84 C5.1 | 37.47,39.37 39.37,41.27 | 39.37,41.27 C16.1 | 39.37,41.27 40.64,40.01 50.93,40.01 R15.1 52.07,40.01 U$2.1 | C24.1 22.23,11.64 C23.1
  Top 0.61: U$1.P9.5 U$1.P9.6 | v10.16,6.67 7.62,9.21 3.86,9.21 CN1.1
  Bottom 0.305: v38.35,20.8 32.5,20.8 24.7,13 24.7,10.73 C24.1
  Bottom 0.406: C5.1 41.91,31.11 42.55,31.75 50.16,31.75 52.07,33.66 59.05,33.66 59.69,33.02 59.69,30.48 57.78,28.57 U$3.1
  Bottom 0.61: U$1.P9.6 22.23,7.62 | 22.23,7.62 C24.1 | v10.16,6.67 21.27,6.67 22.23,7.62
VDD  (via drill 0.51)
  Top 0.305: 50.38,29.63 50.38,29.25 v48.1,26.98 | v46.8,24.7 44.85,24.7 44.52,24.38 U2.15 | U2.15 | U2.27 36.72,19.83 37.7,18.85 | 37.7,18.85 39.65,18.85 39.98,18.52 | 39.98,18.52 U2.7 | U2.15 44.52,19.18 44.2,18.85 40.3,18.85 39.98,18.52 | 37.7,18.85 31.85,18.85 31.54,18.54 C1.1
  Top 0.406: C6.1 50.38,29.63 C7.1 | R8.2 29.08,7.49 C22.1 31.11,12.06 31.43,12.38 31.43,13.23 C1.1
  Top 0.61: R8.2 25.4,6.22 24,6.22 22.86,5.08 U$1.P9.4 U$1.P9.3
  Bottom 0.305: v48.1,26.98 48.1,25.35 47.45,24.7 v46.8,24.7
WCLK  (via drill 0.51)
  Top 0.305: U2.4 38.01,13.34 38.35,13 40.3,13 40.95,13.65 | U2.8 40.62,14.62 40.95,14.3 40.95,13.65 | 40.95,13.65 40.95,11.76 v42.55,10.16
  Bottom 0.254: 54.61,5.71 54.61,3.17
  Bottom 0.305: 54.61,5.71 53.98,6.35 46.35,6.35 v42.55,10.16 | 54.61,3.17 U$1.P9.29